# Altium schematic sheet H3_CPU_01.SchDoc
size A3
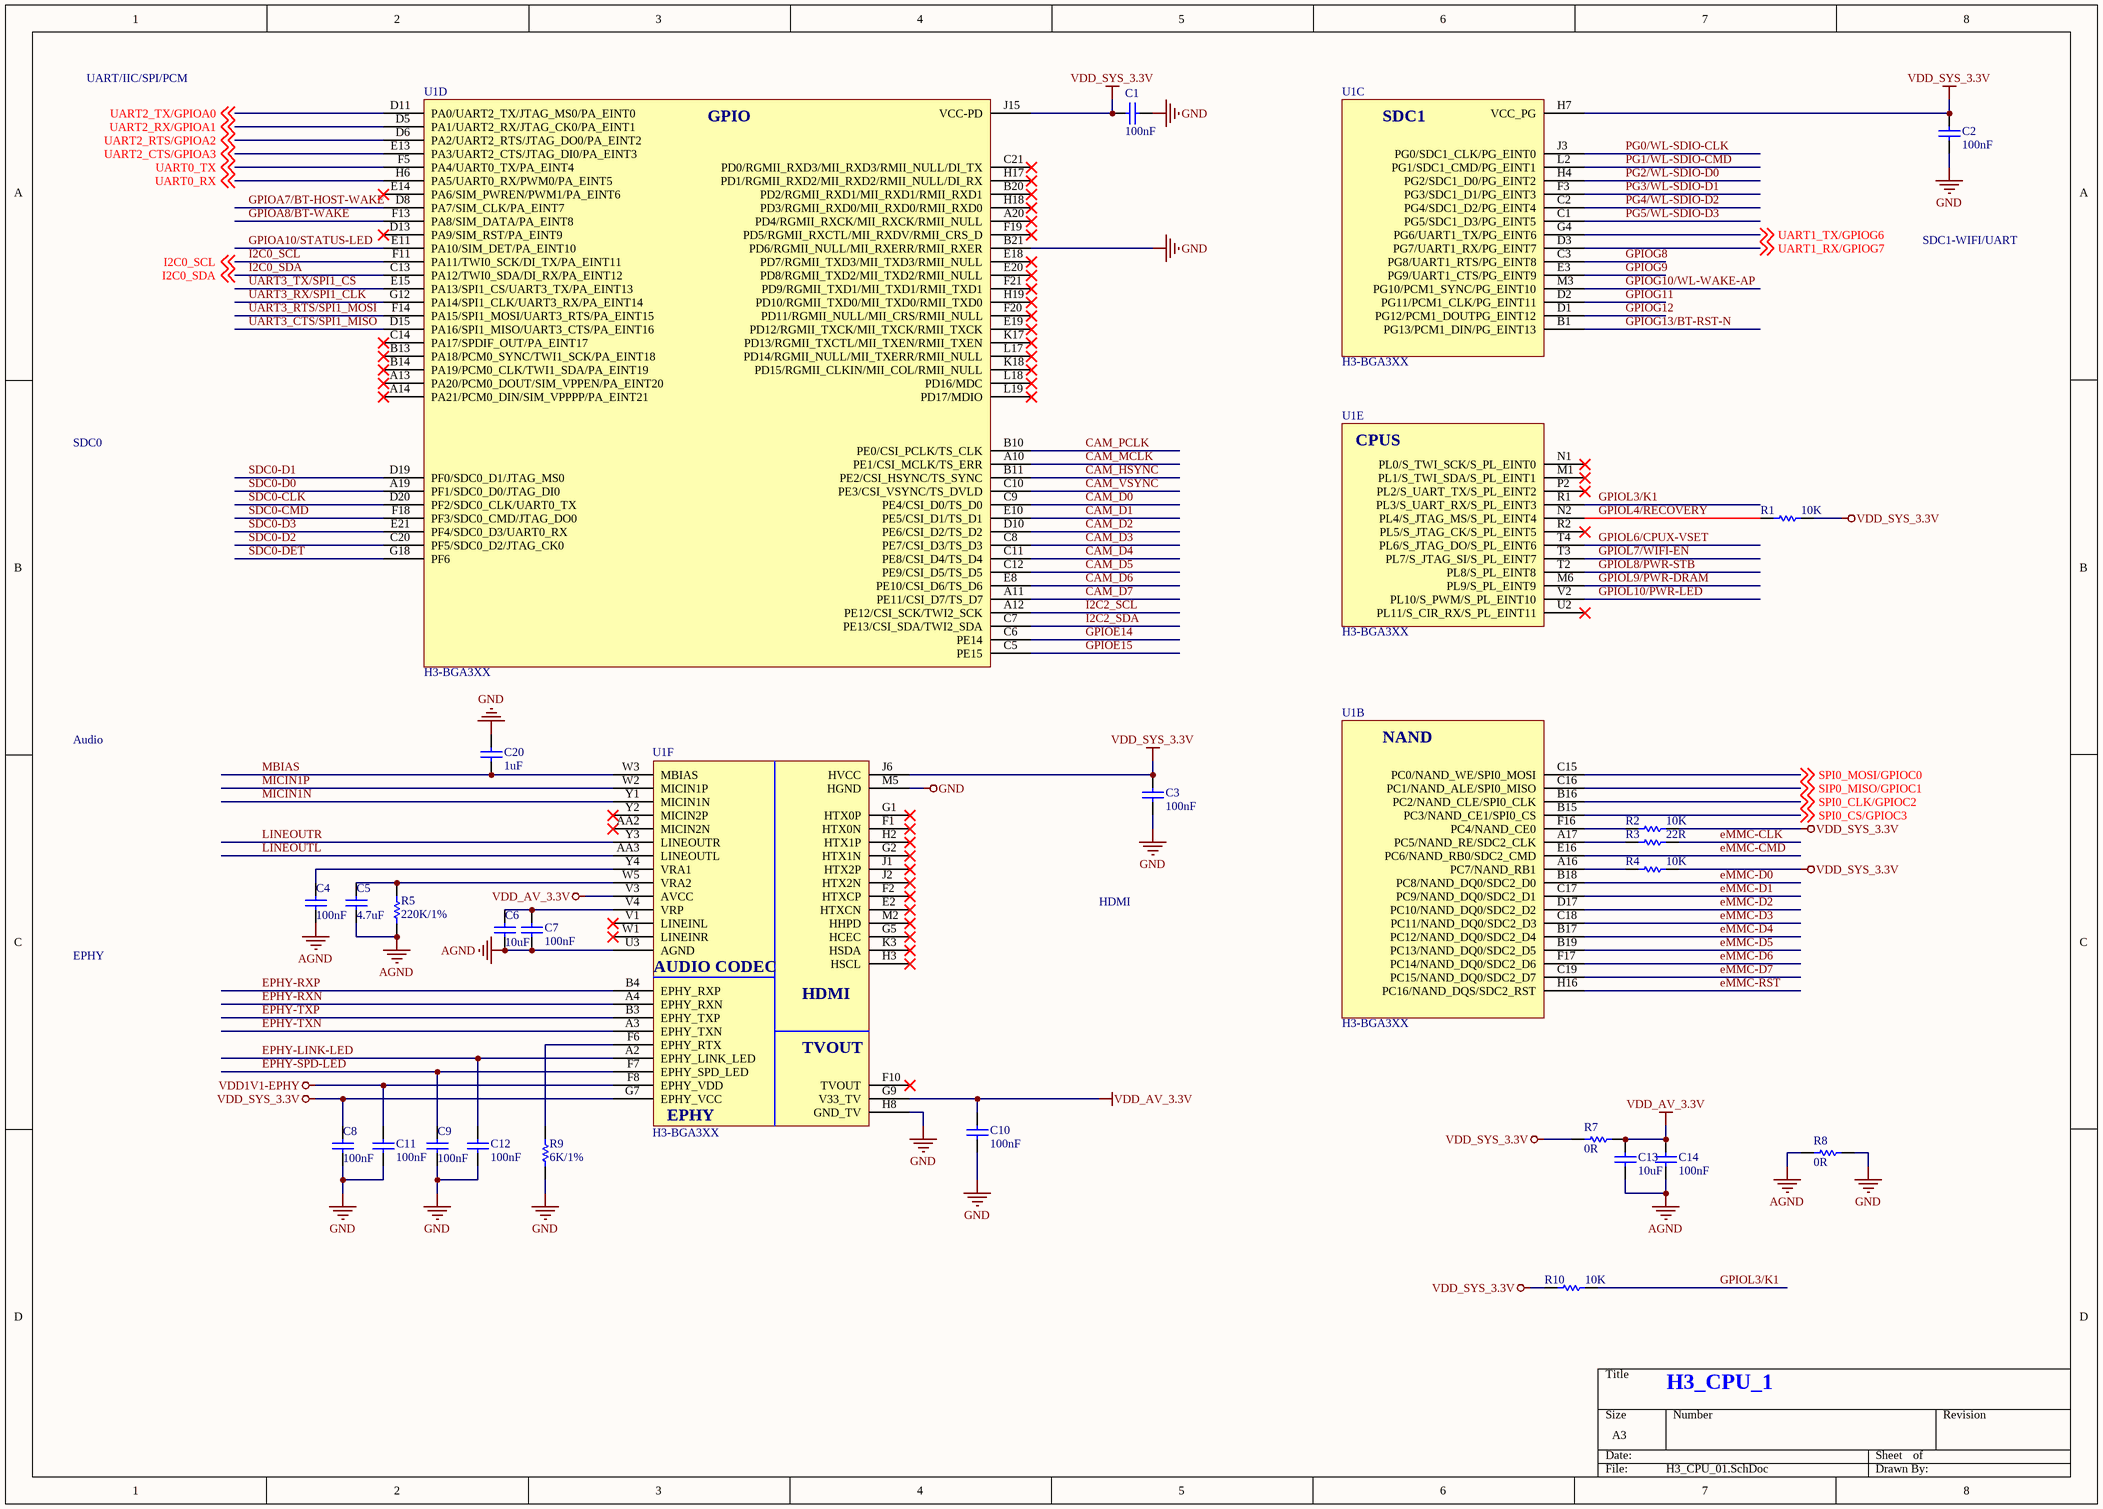
[diagram p0: H3_CPU_01.SchDoc]

## Parts
C1  100nF  [C0402]
C2  100nF  [C0402]
C3  100nF  [C0402]
C4  100nF  [C0402]
C5  4.7uF  [C0402]
C6  10uF  [C0603]
C7  100nF  [C0402]
C8  100nF  [C0402]
C9  100nF  [C0402]
C10  100nF  [C0402]
C11  100nF  [C0402]
C12  100nF  [C0402]
C13  10uF  [C0603]
C14  100nF  [C0402]
C20  1uF  [C0402]
R1  10K  [R0402]
R2  10K  [R0402]
R3  22R  [R0402]
R4  10K  [R0402]
R5  220K/1%  [R0402]
R7  0R  [R0402]
R8  0R  [R0402]
R9  6K/1%  [R0402]
R10  10K  [R0402]
U1  H3-BGA3XX  [BGA-H3-347]  (parts B,C,D,E,F of 9)

## Nets
AGND: C4.1 C5.1 C6.1 C7.1 C13.1 C14.1 R5.1 R8.1 U1.U3(AGND)
GND: C1.1 C2.1 C3.1 C8.1 C9.1 C10.1 C11.1 C12.1 C20.2 R8.2 R9.1 U1.B21(PD6/RGMII_NULL/MII_RXERR/RMII_RXER) U1.H8(GND_TV) U1.M5(HGND)
VDD1V1-EPHY: C11.2 U1.F8(EPHY_VDD)
VDD_AV_3.3V: C10.2 C13.2 C14.2 R7.2 U1.G9(V33_TV) U1.V3(AVCC)
VDD_SYS_3.3V: C1.2 C2.2 C3.2 C8.2 R1.1 R2.1 R4.1 R7.1 R10.2 U1.G7(EPHY_VCC) U1.H7(VCC_PG) U1.J6(HVCC) U1.J15(VCC-PD)
CAM_D0: U1.C9(PE4/CSI_D0/TS_D0)
CAM_D1: U1.E10(PE5/CSI_D1/TS_D1)
CAM_D2: U1.D10(PE6/CSI_D2/TS_D2)
CAM_D3: U1.C8(PE7/CSI_D3/TS_D3)
CAM_D4: U1.C11(PE8/CSI_D4/TS_D4)
CAM_D5: U1.C12(PE9/CSI_D5/TS_D5)
CAM_D6: U1.E8(PE10/CSI_D6/TS_D6)
CAM_D7: U1.A11(PE11/CSI_D7/TS_D7)
CAM_HSYNC: U1.B11(PE2/CSI_HSYNC/TS_SYNC)
CAM_MCLK: U1.A10(PE1/CSI_MCLK/TS_ERR)
CAM_PCLK: U1.B10(PE0/CSI_PCLK/TS_CLK)
CAM_VSYNC: U1.C10(PE3/CSI_VSYNC/TS_DVLD)
eMMC-CLK: R3.1
eMMC-CMD: U1.E16(PC6/NAND_RB0/SDC2_CMD)
eMMC-D0: U1.B18(PC8/NAND_DQ0/SDC2_D0)
eMMC-D1: U1.C17(PC9/NAND_DQ0/SDC2_D1)
eMMC-D2: U1.D17(PC10/NAND_DQ0/SDC2_D2)
eMMC-D3: U1.C18(PC11/NAND_DQ0/SDC2_D3)
eMMC-D4: U1.B17(PC12/NAND_DQ0/SDC2_D4)
eMMC-D5: U1.B19(PC13/NAND_DQ0/SDC2_D5)
eMMC-D6: U1.F17(PC14/NAND_DQ0/SDC2_D6)
eMMC-D7: U1.C19(PC15/NAND_DQ0/SDC2_D7)
eMMC-RST: U1.H16(PC16/NAND_DQS/SDC2_RST)
EPHY-LINK-LED: C12.2 U1.A2(EPHY_LINK_LED)
EPHY-RXN: U1.A4(EPHY_RXN)
EPHY-RXP: U1.B4(EPHY_RXP)
EPHY-SPD-LED: C9.2 U1.F7(EPHY_SPD_LED)
EPHY-TXN: U1.A3(EPHY_TXN)
EPHY-TXP: U1.B3(EPHY_TXP)
GPIOA7/BT-HOST-WAKE: U1.D8(PA7/SIM_CLK/PA_EINT7)
GPIOA8/BT-WAKE: U1.F13(PA8/SIM_DATA/PA_EINT8)
GPIOA10/STATUS-LED: U1.E11(PA10/SIM_DET/PA_EINT10)
GPIOE14: U1.C6(PE14)
GPIOE15: U1.C5(PE15)
GPIOG8: U1.C3(PG8/UART1_RTS/PG_EINT8)
GPIOG9: U1.E3(PG9/UART1_CTS/PG_EINT9)
GPIOG10/WL-WAKE-AP: U1.M3(PG10/PCM1_SYNC/PG_EINT10)
GPIOG11: U1.D2(PG11/PCM1_CLK/PG_EINT11)
GPIOG12: U1.D1(PG12/PCM1_DOUTPG_EINT12)
GPIOG13/BT-RST-N: U1.B1(PG13/PCM1_DIN/PG_EINT13)
GPIOL3/K1: R10.1 U1.R1(PL3/S_UART_RX/S_PL_EINT3)
GPIOL4/RECOVERY: R1.2 U1.N2(PL4/S_JTAG_MS/S_PL_EINT4)
GPIOL6/CPUX-VSET: U1.T4(PL6/S_JTAG_DO/S_PL_EINT6)
GPIOL7/WIFI-EN: U1.T3(PL7/S_JTAG_SI/S_PL_EINT7)
GPIOL8/PWR-STB: U1.T2(PL8/S_PL_EINT8)
GPIOL9/PWR-DRAM: U1.M6(PL9/S_PL_EINT9)
GPIOL10/PWR-LED: U1.V2(PL10/S_PWM/S_PL_EINT10)
I2C0_SCL: U1.F11(PA11/TWI0_SCK/DI_TX/PA_EINT11) ; off-sheet I2C0_SCL
I2C0_SDA: U1.C13(PA12/TWI0_SDA/DI_RX/PA_EINT12) ; off-sheet I2C0_SDA
I2C2_SCL: U1.A12(PE12/CSI_SCK/TWI2_SCK)
I2C2_SDA: U1.C7(PE13/CSI_SDA/TWI2_SDA)
LINEOUTL: U1.AA3(LINEOUTL)
LINEOUTR: U1.Y3(LINEOUTR)
MBIAS: C20.1 U1.W3(MBIAS)
MICIN1N: U1.Y1(MICIN1N)
MICIN1P: U1.W2(MICIN1P)
PG0/WL-SDIO-CLK: U1.J3(PG0/SDC1_CLK/PG_EINT0)
PG1/WL-SDIO-CMD: U1.L2(PG1/SDC1_CMD/PG_EINT1)
PG2/WL-SDIO-D0: U1.H4(PG2/SDC1_D0/PG_EINT2)
PG3/WL-SDIO-D1: U1.F3(PG3/SDC1_D1/PG_EINT3)
PG4/WL-SDIO-D2: U1.C2(PG4/SDC1_D2/PG_EINT4)
PG5/WL-SDIO-D3: U1.C1(PG5/SDC1_D3/PG_EINT5)
SDC0-CLK: U1.D20(PF2/SDC0_CLK/UART0_TX)
SDC0-CMD: U1.F18(PF3/SDC0_CMD/JTAG_DO0)
SDC0-D0: U1.A19(PF1/SDC0_D0/JTAG_DI0)
SDC0-D1: U1.D19(PF0/SDC0_D1/JTAG_MS0)
SDC0-D2: U1.C20(PF5/SDC0_D2/JTAG_CK0)
SDC0-D3: U1.E21(PF4/SDC0_D3/UART0_RX)
SDC0-DET: U1.G18(PF6)
SIP0_MISO/GPIOC1: U1.C16(PC1/NAND_ALE/SPI0_MISO) ; off-sheet SIP0_MISO/GPIOC1
SPI0_CLK/GPIOC2: U1.B16(PC2/NAND_CLE/SPI0_CLK) ; off-sheet SPI0_CLK/GPIOC2
SPI0_CS/GPIOC3: U1.B15(PC3/NAND_CE1/SPI0_CS) ; off-sheet SPI0_CS/GPIOC3
SPI0_MOSI/GPIOC0: U1.C15(PC0/NAND_WE/SPI0_MOSI) ; off-sheet SPI0_MOSI/GPIOC0
UART0_RX: U1.H6(PA5/UART0_RX/PWM0/PA_EINT5) ; off-sheet UART0_RX
UART0_TX: U1.F5(PA4/UART0_TX/PA_EINT4) ; off-sheet UART0_TX
UART1_RX/GPIOG7: U1.D3(PG7/UART1_RX/PG_EINT7) ; off-sheet UART1_RX/GPIOG7
UART1_TX/GPIOG6: U1.G4(PG6/UART1_TX/PG_EINT6) ; off-sheet UART1_TX/GPIOG6
UART2_CTS/GPIOA3: U1.E13(PA3/UART2_CTS/JTAG_DI0/PA_EINT3) ; off-sheet UART2_CTS/GPIOA3
UART2_RTS/GPIOA2: U1.D6(PA2/UART2_RTS/JTAG_DO0/PA_EINT2) ; off-sheet UART2_RTS/GPIOA2
UART2_RX/GPIOA1: U1.D5(PA1/UART2_RX/JTAG_CK0/PA_EINT1) ; off-sheet UART2_RX/GPIOA1
UART2_TX/GPIOA0: U1.D11(PA0/UART2_TX/JTAG_MS0/PA_EINT0) ; off-sheet UART2_TX/GPIOA0
UART3_CTS/SPI1_MISO: U1.D15(PA16/SPI1_MISO/UART3_CTS/PA_EINT16)
UART3_RTS/SPI1_MOSI: U1.F14(PA15/SPI1_MOSI/UART3_RTS/PA_EINT15)
UART3_RX/SPI1_CLK: U1.G12(PA14/SPI1_CLK/UART3_RX/PA_EINT14)
UART3_TX/SPI1_CS: U1.E15(PA13/SPI1_CS/UART3_TX/PA_EINT13)
NetC4_2: C4.2 U1.Y4(VRA1)
NetC5_2: C5.2 R5.2 U1.W5(VRA2)
NetC6_2: C6.2 C7.2 U1.V4(VRP)
NetR2_2: R2.2 U1.F16(PC4/NAND_CE0)
NetR3_2: R3.2 U1.A17(PC5/NAND_RE/SDC2_CLK)
NetR4_2: R4.2 U1.A16(PC7/NAND_RB1)
NetR9_2: R9.2 U1.F6(EPHY_RTX)

Not connected (* = marked no-connect by the designer): U1 A13(PA20/PCM0_DOUT/SIM_VPPEN/PA_EINT20)* A14(PA21/PCM0_DIN/SIM_VPPPP/PA_EINT21)* A20(PD4/RGMII_RXCK/MII_RXCK/RMII_NULL)* AA2(MICIN2N)* B13(PA18/PCM0_SYNC/TWI1_SCK/PA_EINT18)* B14(PA19/PCM0_CLK/TWI1_SDA/PA_EINT19)* B20(PD2/RGMII_RXD1/MII_RXD1/RMII_RXD1)* C14(PA17/SPDIF_OUT/PA_EINT17)* C21(PD0/RGMII_RXD3/MII_RXD3/RMII_NULL/DI_TX)* D13(PA9/SIM_RST/PA_EINT9)* E2(HTXCN)* E14(PA6/SIM_PWREN/PWM1/PA_EINT6)* E18(PD7/RGMII_TXD3/MII_TXD3/RMII_NULL)* E19(PD12/RGMII_TXCK/MII_TXCK/RMII_TXCK)* E20(PD8/RGMII_TXD2/MII_TXD2/RMII_NULL)* F1(HTX0N)* F2(HTXCP)* F10(TVOUT)* F19(PD5/RGMII_RXCTL/MII_RXDV/RMII_CRS_D)* F20(PD11/RGMII_NULL/MII_CRS/RMII_NULL)* F21(PD9/RGMII_TXD1/MII_TXD1/RMII_TXD1)* G1(HTX0P)* G2(HTX1N)* G5(HCEC)* H2(HTX1P)* H3(HSCL)* H17(PD1/RGMII_RXD2/MII_RXD2/RMII_NULL/DI_RX)* H18(PD3/RGMII_RXD0/MII_RXD0/RMII_RXD0)* H19(PD10/RGMII_TXD0/MII_TXD0/RMII_TXD0)* J1(HTX2P)* J2(HTX2N)* K3(HSDA)* K17(PD13/RGMII_TXCTL/MII_TXEN/RMII_TXEN)* K18(PD15/RGMII_CLKIN/MII_COL/RMII_NULL)* L17(PD14/RGMII_NULL/MII_TXERR/RMII_NULL)* L18(PD16/MDC)* L19(PD17/MDIO)* M1(PL1/S_TWI_SDA/S_PL_EINT1)* M2(HHPD)* N1(PL0/S_TWI_SCK/S_PL_EINT0)* P2(PL2/S_UART_TX/S_PL_EINT2)* R2(PL5/S_JTAG_CK/S_PL_EINT5)* U2(PL11/S_CIR_RX/S_PL_EINT11)* V1(LINEINL)* W1(LINEINR)* Y2(MICIN2P)*

## Notes on the sheet
- UART/IIC/SPI/PCM
- SDC1-WIFI/UART
- SDC0
- Audio
- HDMI
- EPHY
- H3_CPU_1
- (in symbol H3-BGA3XX, part B) NAND
- (in symbol H3-BGA3XX, part C) SDC1
- (in symbol H3-BGA3XX, part D) GPIO
- (in symbol H3-BGA3XX, part E) CPUS
- (in symbol H3-BGA3XX, part F) AUDIO CODEC; HDMI; EPHY

## Library data of the parts
C1-C5 C7-C12 C14 C20 = C0402: 电容; Published: 8-Jun-2000; LatestRevisionDate: 17-Jul-2002; LatestRevisionNote: Re-released for DXP Platform.; PackageReference: RAD-0.3; Publisher: Altium Limited; PackageDescription: Radial Cap, Thru-Hole; 2 Leads; 0.3 in Pin Spacing; UnitPrice: 0.02
C6 C13 = C0603: 电容; Published: 8-Jun-2000; LatestRevisionDate: 17-Jul-2002; LatestRevisionNote: Re-released for DXP Platform.; PackageReference: RAD-0.3; Publisher: Altium Limited; PackageDescription: Radial Cap, Thru-Hole; 2 Leads; 0.3 in Pin Spacing; UnitPrice: 0.02
R1-R5 R7-R10 = RES0402: 电阻; Published: 8-Jun-2000; LatestRevisionDate: 17-Jul-2002; LatestRevisionNote: Re-released for DXP Platform.; PackageReference: AXIAL-0.3; Publisher: Altium Limited; PackageDescription: Axial Device, Thru-Hole; 2 Leads; 0.3 in Pin Spacing